# EAGLE design driver (EAGLE 5.11)
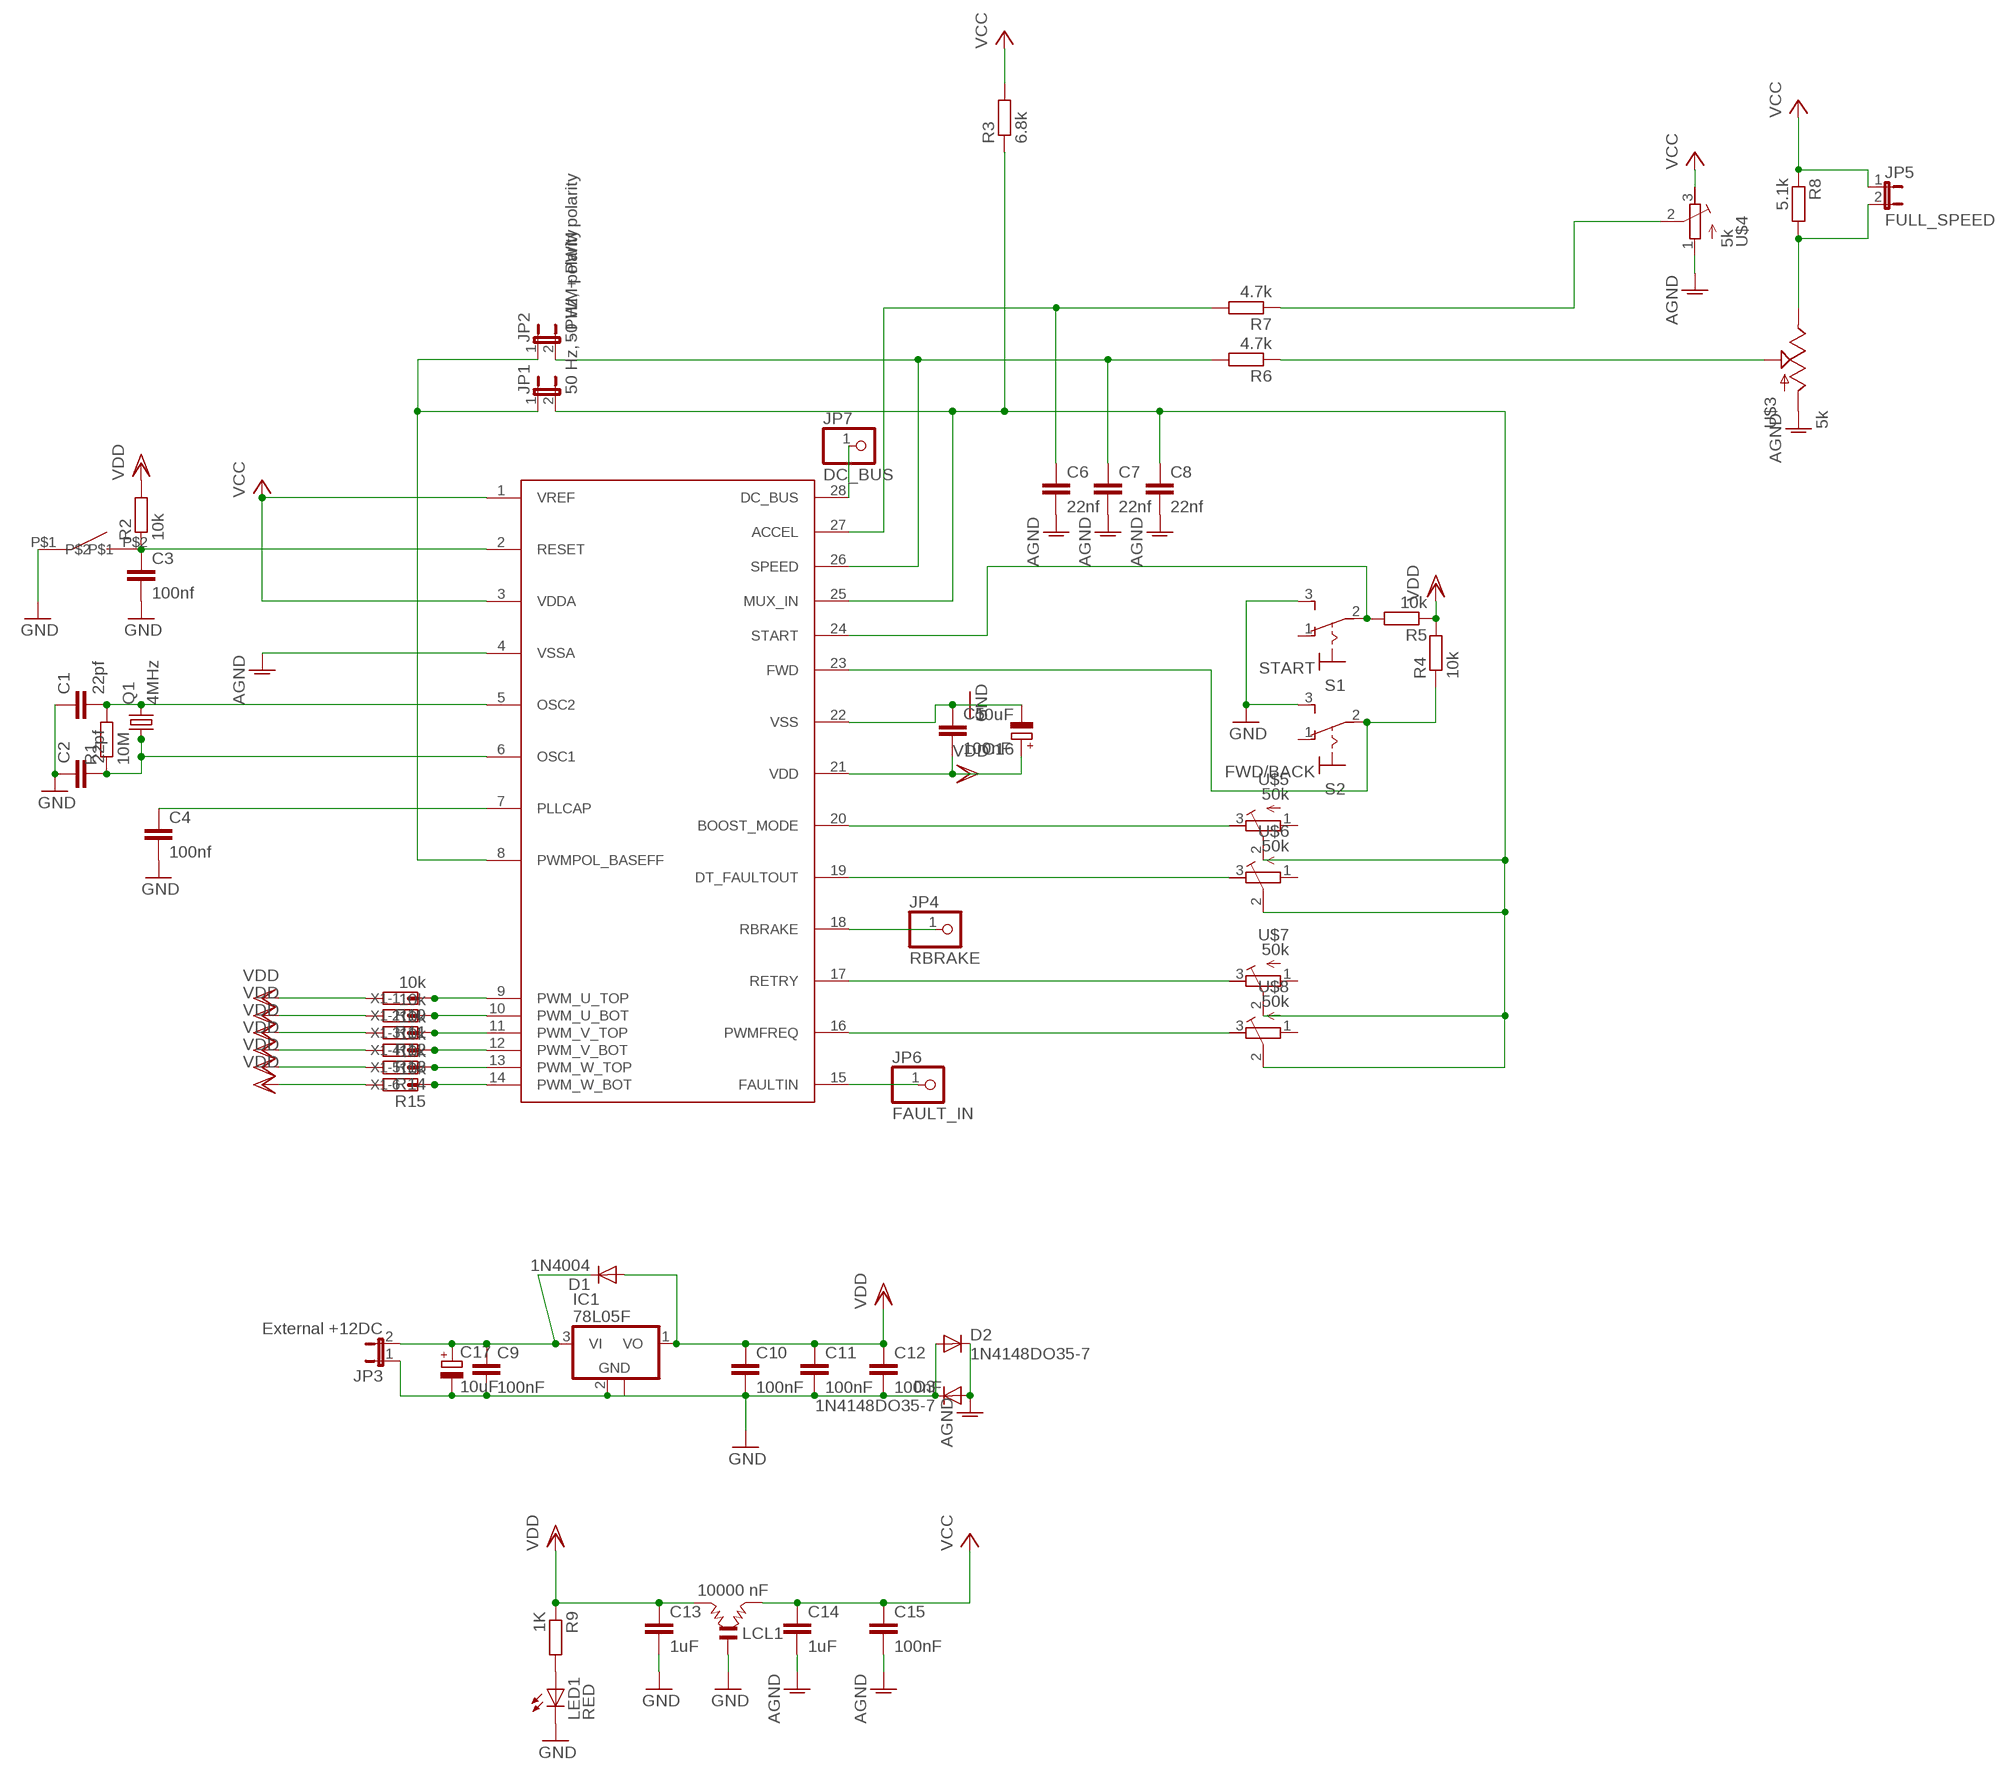
[diagram p0: schematic, sheet 1]

## Parts
C1  22pf  C-EUC0805  [C0805]
C2  22pf  C-EUC0805  [C0805]
C3  100nf  C-EUC0805  [C0805]
C4  100nf  C-EUC0805  [C0805]
C5  100nF  C-EUC0805  [C0805]
C6  22nf  C-EUC0805  [C0805]
C7  22nf  C-EUC0805  [C0805]
C8  22nf  C-EUC0805  [C0805]
C9  100nF  C-EUC0805  [C0805]
C10  100nF  C-EUC0805  [C0805]
C11  100nF  C-EUC0805  [C0805]
C12  100nF  C-EUC0805  [C0805]
C13  1uF  C-EUC0805  [C0805]
C14  1uF  C-EUC0805  [C0805]
C15  100nF  C-EUC0805  [C0805]
C16  10uF  CPOL-EUE2,5-6E  [E2,5-6E]
C17  10uF  CPOL-EUE2,5-6E  [E2,5-6E]
D1  1N4004  [DO41-10]
D2  1N4148DO35-7  DIODE-SOD80C  [SOD80C]
D3  1N4148DO35-7  DIODE-SOD80C  [SOD80C]
IC1  78L05F  [SOT89]
JP1  50 Hz, - PWM polarity  JUMPER-2PTH  [1X02]
JP2  50 Hz, + PWM polarity  JUMPER-2PTH  [1X02]
JP3  External +12DC  JUMPER-2PTH  [1X02]
JP4  RBRAKE  PINHD-1X1  [1X01]
JP5  FULL_SPEED  JUMPER-2PTH  [1X02]
JP6  FAULT_IN  PINHD-1X1  [1X01]
JP7  DC_BUS  PINHD-1X1  [1X01]
LCL1  10000 nF  LCL  [LCL]
LED1  RED  LED5MM  [LED5MM]
Q1  4MHz  CRYSTALHC49S  [HC49/S]
R1  10M  R-EU_R0805  [R0805]
R2  10k  R-EU_R0805  [R0805]
R3  6.8k  R-EU_R0805  [R0805]
R4  10k  R-EU_R0805  [R0805]
R5  10k  R-EU_R0805  [R0805]
R6  4.7k  R-EU_R0805  [R0805]
R7  4.7k  R-EU_R0805  [R0805]
R8  5.1k  R-EU_R0805  [R0805]
R9  1K  R-EU_R0805  [R0805]
R10  10k  R-EU_R0805  [R0805]
R11  10k  R-EU_R0805  [R0805]
R12  10k  R-EU_R0805  [R0805]
R13  10k  R-EU_R0805  [R0805]
R14  10k  R-EU_R0805  [R0805]
R15  10k  R-EU_R0805  [R0805]
S1  START  320-916  [320-916]
S2  FWD/BACK  320-916  [320-916]
U$1  MC3PHAC  [SO-28W]
U$2  TAC_SWITCH-3302  [TAC_SWITCH]
U$3  5k  POT-RV16AF-20  [POT_ALPHA_RV16AF-20]
U$4  5k  R-TRIMM3339P  [RTRIM3339P]
U$5  50k  R-TRIMM3339P  [RTRIM3339P]
U$6  50k  R-TRIMM3339P  [RTRIM3339P]
U$7  50k  R-TRIMM3339P  [RTRIM3339P]
U$8  50k  R-TRIMM3339P  [RTRIM3339P]
X1  22-23-2061  [22-23-2061]

## Nets
AGND: C6.2 C7.2 C8.2 C14.2 C15.2 D2.C D3.A U$1.4(VSSA) U$3.1(A) U$4.1(E)
GND: C1.1 C2.1 C3.2 C4.2 C5.1 C9.2 C10.2 C11.2 C12.2 C13.2 C16.- C17.- D2.A D3.C IC1.2(GND) JP3.1 LCL1.0(GND) LED1.K(C) S1.3(S) S2.3(S) U$1.22(VSS) U$2.P$1
N$1: C1.2 Q1.2 R1.2 U$1.5(OSC2)
N$2: C2.2 Q1.1 R1.1 U$1.6(OSC1)
N$3: JP1.1 JP2.1 U$1.8(PWMPOL_BASEFF)
N$4: C4.1 U$1.7(PLLCAP)
N$5: C3.1 R2.1 U$1.2(RESET) U$2.P$2
N$6: U$1.19(DT_FAULTOUT) U$6.3(A)
N$7: C7.1 JP2.2 R6.2 U$1.26(SPEED)
N$8: C8.1 JP1.2 R3.1 U$1.25(MUX_IN) U$5.2(S) U$6.2(S) U$7.2(S) U$8.2(S)
N$9: C6.1 R7.2 U$1.27(ACCEL)
N$10: R5.2 S1.2(P) U$1.24(START)
N$11: R6.1 U$3.2(S)
N$12: R4.1 S2.2(P) U$1.23(FWD)
N$13: R7.1 U$4.2(S)
N$14: JP5.2 R8.2 U$3.3(E)
N$15: U$1.17(RETRY) U$7.3(A)
N$16: U$1.20(BOOST_MODE) U$5.3(A)
N$17: U$1.16(PWMFREQ) U$8.3(A)
N$18: JP4.1 U$1.18(RBRAKE)
N$19: LED1.A R9.2
N$20: C9.1 C17.+ D1.C IC1.3(VI) JP3.2
N$21: JP6.1 U$1.15(FAULTIN)
N$22: JP7.1 U$1.28(DC_BUS)
N$23: R10.1 U$1.9(PWM_U_TOP) X1.1
N$24: R11.1 U$1.10(PWM_U_BOT) X1.2
N$25: R12.1 U$1.11(PWM_V_TOP) X1.3
N$26: R13.1 U$1.12(PWM_V_BOT) X1.4
N$27: R14.1 U$1.13(PWM_W_TOP) X1.5
N$28: R15.1 U$1.14(PWM_W_BOT) X1.6
VCC: C14.1 C15.1 JP5.1 LCL1.2 R3.2 R8.1 U$1.1(VREF) U$1.3(VDDA) U$4.3(A)
VDD: C5.2 C10.1 C11.1 C12.1 C13.1 C16.+ D1.A IC1.1(VO) LCL1.1 R2.2 R4.2 R5.1 R9.1 R10.2 R11.2 R12.2 R13.2 R14.2 R15.2 U$1.21(VDD)
Unconnected: IC1.2@1(GND) S1.1(O) S2.1(O) U$5.1(E) U$6.1(E) U$7.1(E) U$8.1(E)

## Library data of the parts
C1-C15 = resistor:C-EU: CAPACITOR, European symbol
C16 C17 = resistor:CPOL-EU: POLARIZED CAPACITOR, European symbol
D1 = diode:1N4004: DIODE general purpose rectifier, 1 A
D2 D3 = diode:DIODE-: DIODE
IC1 = linear:78L*: POSITOIV-VOLTAGE REGULATORS Output up to 100 mA Source: http://focus.ti.com/lit/ds/symlink/ua78l05.pdf
JP1-JP3 JP5 = SparkFun:JUMPER-2: Jumper Basic 0.1" spaced jumper. Use with breakaway headers.
JP4 JP6 JP7 = pinhead:PINHD-1X1: PIN HEADER
LCL1 = murata-filter:LCL: FILTER; MPN: LCL; OC_FARNELL: 106331; OC_NEWARK: 06WX8509
LED1 = led:LED: LED OSRAM: - CHIPLED LG R971, LG N971, LY N971, LG Q971, LY Q971, LO R971, LY R971 LH N974, LH R974 LS Q976, LO Q976, LY Q976 LO Q996 - Hyper CHIPLED LW Q18S LB Q993, LB Q99A, LB R99A - SideLED LS A670, LO A670, LY A670, LG A670, LP A670 LB A673, LV A673, LT A673, LW A673 LH A674 LY A675 LS A676, LA A676, LO A676, LY A676, LW A676 LS A679, LY A679, LG A679 - Hyper Micro SIDELED® LS Y876, LA Y876, LO Y876, LY Y876 LT Y87S - SmartLED LW L88C, LW L88S LB L89C, LB L89S, LG L890 LS L89K, LO L89K, LY L89K LS L896, LA L896, LO L896, LY L896 - TOPLED LS T670, LO T670, LY T670, LG T670, LP T670 LSG T670, LSP T670, LSY T670, LOP T670, LYG T670 LG T671, LOG T671, LSG T671 LB T673, LV T673, LT T673, LW T673 LH T674 LS T676, LA T676, LO T676, LY T676, LB T676, LH T676, LSB T676, LW T676 LB T67C, LV T67C, LT T67C, LS T67K, LO T67K, LY T67K, LW E67C LS E67B, LA E67B, LO E67B, LY E67B, LB E67C, LV E67C, LT E67C LW T67C LS T679, LY T679, LG T679 LS T770, LO T770, LY T770, LG T770, LP T770 LB T773, LV T773, LT T773, LW T773 LH T774 LS E675, LA E675, LY E675, LS T675 LS T776, LA T776, LO T776, LY T776, LB T776 LHGB T686 LT T68C, LB T68C - Hyper Mini TOPLED® LB M676 - Mini TOPLED Santana® LG M470 LS M47K, LO M47K, LY M47K Source: http://www.osram.convergy.de LUXEON: - LUMILED® LXK2-PW12-R00, LXK2-PW12-S00, LXK2-PW14-U00, LXK2-PW14-V00 LXK2-PM12-R00, LXK2-PM12-S00, LXK2-PM14-U00 LXK2-PE12-Q00, LXK2-PE12-R00, LXK2-PE12-S00, LXK2-PE14-T00, LXK2-PE14-U00 LXK2-PB12-K00, LXK2-PB12-L00, LXK2-PB12-M00, LXK2-PB14-N00, LXK2-PB14-P00, LXK2-PB14-Q00 LXK2-PR12-L00, LXK2-PR12-M00, LXK2-PR14-Q00, LXK2-PR14-R00 LXK2-PD12-Q00, LXK2-PD12-R00, LXK2-PD12-S00 LXK2-PH12-R00, LXK2-PH12-S00 LXK2-PL12-P00, LXK2-PL12-Q00, LXK2-PL12-R00 Source: www.luxeon.com KINGBRIGHT: KA-3528ASYC Source: www.kingbright.com
Q1 = crystal:CRYSTAL: CRYSTAL; OC_FARNELL: 1667008; OC_NEWARK: unknown
R1-R15 = resistor:R-EU_: RESISTOR, European symbol
S1 S2 = switch:320-916: TOGGLE SWITCH distributor RS Components
U$1 = motor driver parts:MC3PHAC
U$2 = motor driver parts:TAC_SWITCH-3302
U$3 = SparkFun:POT
U$4-U$8 = resistor:R-TRIMM: Trimm resistor
X1 = con-molex:22-23-2061: .100" (2.54mm) Center Header - 6 Pin; MF: MOLEX; MPN: 22-23-2061; OC_FARNELL: 1462922; OC_NEWARK: 27C1933

## Board
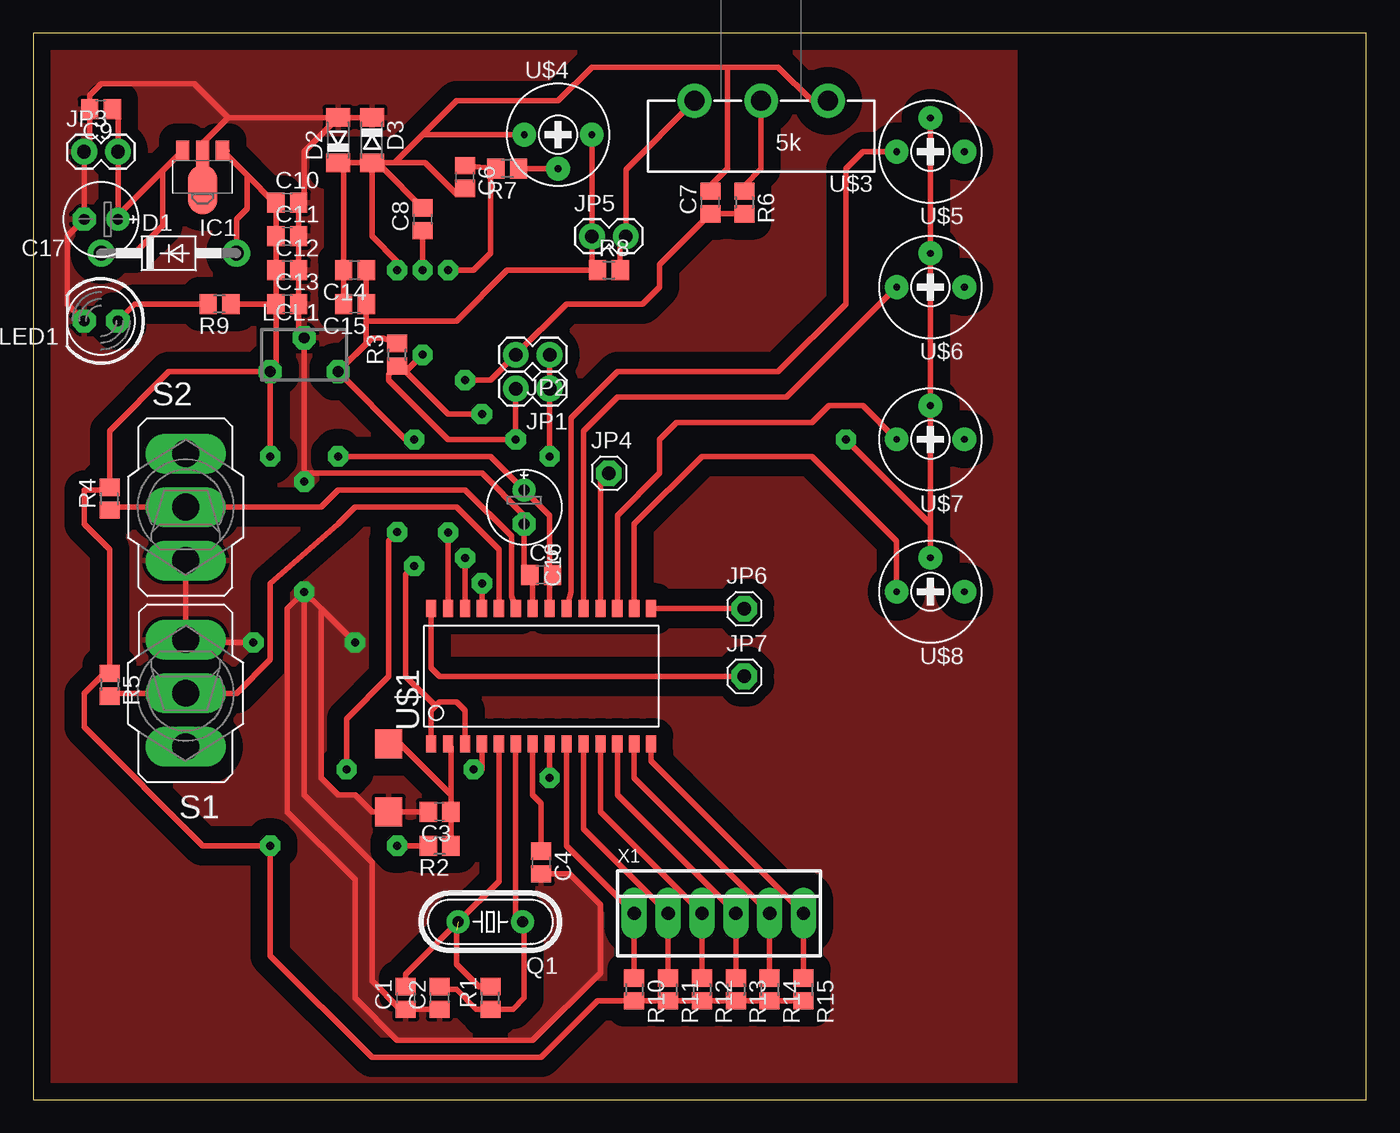
[diagram p1: board, top side]
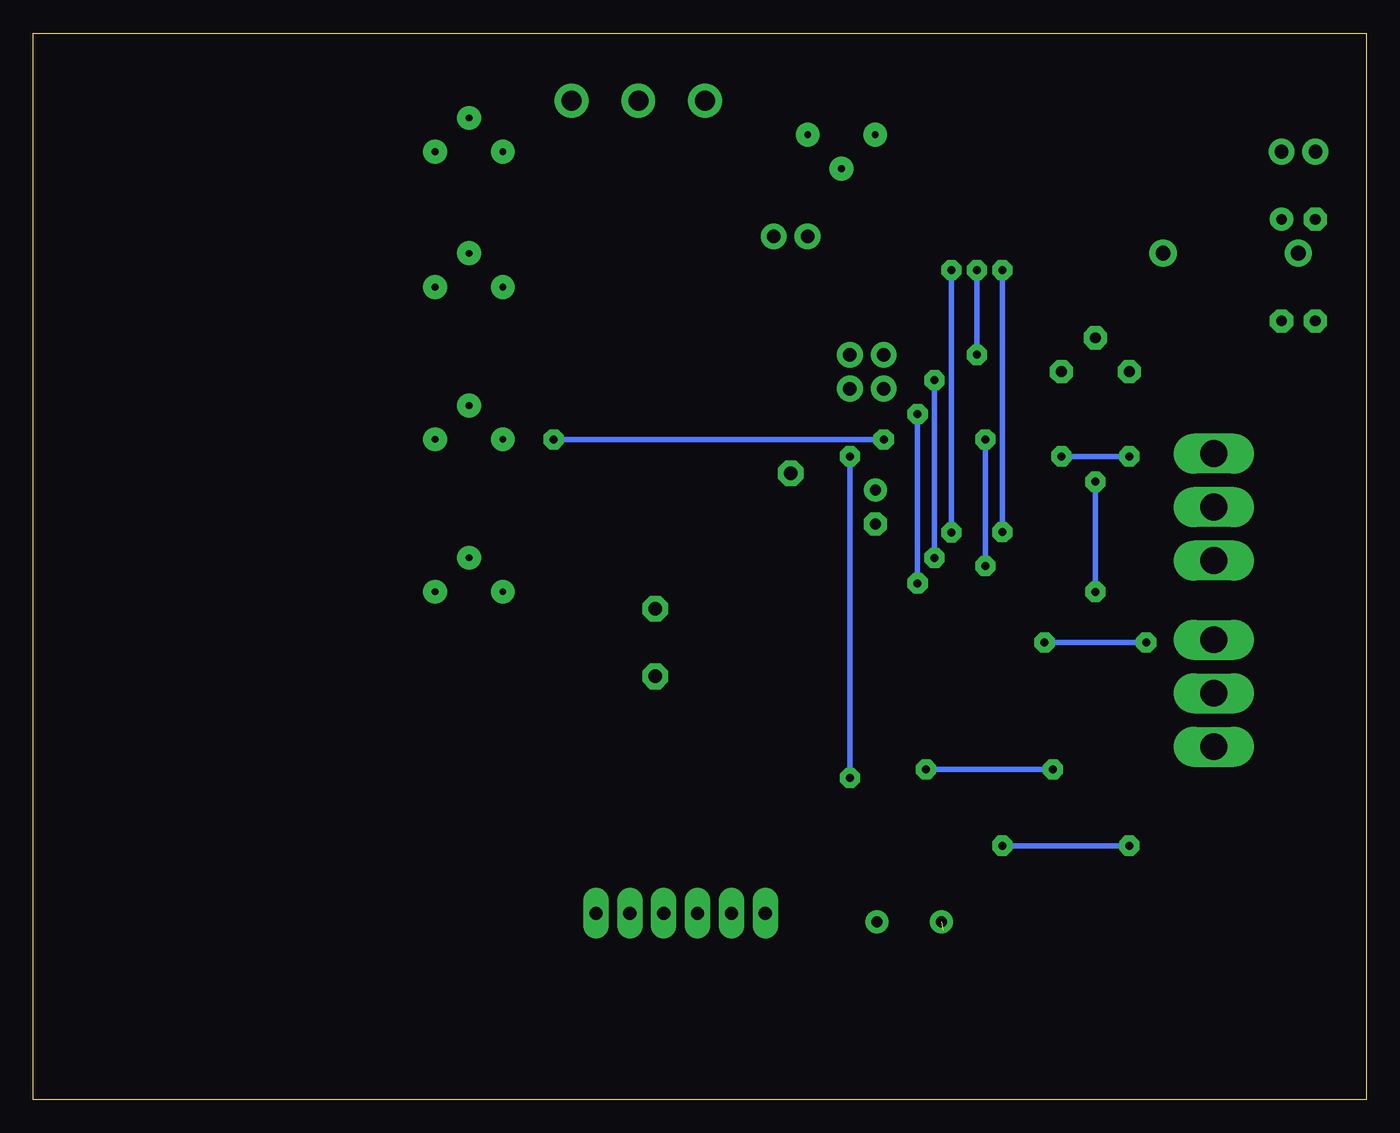
[diagram p2: board, bottom side, seen from below]

Size 100 x 80 mm. Coordinates in mm from the lower left corner, seen from the top.
Outline: 0,0 100,0 100,80 0,80 0,0
Copper layers (1*16): Top 0.035mm / dielectric 1.5mm / Bottom 0.035mm
Design rules "default *": minimum track width 10mil, minimum drill 10mil, track to track 8mil, track to pad 8mil, pad to pad 8mil, via to via 8mil, smd to smd 8mil, copper to edge 40mil, drill to drill 8mil, minimum pad ring 18mil, minimum via ring 18mil, stop-mask expansion 4mil, vias tented up to drill 0mil, thermal gap 10mil

### Footprints (pad centres in the part's own frame; a part is rotated, then mirrored left to right if it is on the bottom)
C0805 = smd 1.3 x 1.5: 1 -0.85,0; 2 0.85,0
E2,5-6E = drill 0.813 pad 1.575 round: + -1.27,0 | drill 0.813 pad 1.575 octagon: - 1.27,0
DO41-10 = drill 1.118 round: A 5.08,0; C -5.08,0
SOD80C = smd 1.4 x 1.8: A 1.7,0; C -1.7,0
SOT89 = smd 1 x 1.5: 1 -1.499,-1.981; 3 1.499,-1.981 | smd 1 x 2: 2 0,-1.727 | smd 2.2 x 3.7: 2@1 0,0.94
1X02 = drill 1.016 pad 1.88 round: 1 0,0; 2 2.54,0
1X01 = drill 1.016 octagon: 1 0,0
LCL = drill 0.813 octagon: 0 0,1.27; 1 -2.54,-1.27; 2 2.54,-1.27
LED5MM = drill 0.813 octagon: A -1.27,0; K 1.27,0
HC49/S = drill 0.813 round: 1 -2.413,0; 2 2.413,0
R0805 = smd 1.3 x 1.5: 1 -0.85,0; 2 0.85,0
320-916 = drill 2.007 long: 1 0,4.013; 2 0,0; 3 0,-4.013
SO-28W = smd 0.762 x 1.27: 1 -8.255,-5.08; 2 -6.985,-5.08; 3 -5.715,-5.08; 4 -4.445,-5.08; 5 -3.175,-5.08; 6 -1.905,-5.08; 7 -0.635,-5.08; 8 0.635,-5.08; 9 1.905,-5.08; 10 3.175,-5.08; 11 4.445,-5.08; 12 5.715,-5.08; 13 6.985,-5.08; 14 8.255,-5.08; 15 8.255,5.08; 16 6.985,5.08; 17 5.715,5.08; 18 4.445,5.08; 19 3.175,5.08; 20 1.905,5.08; 21 0.635,5.08; 22 -0.635,5.08; 23 -1.905,5.08; 24 -3.175,5.08; 25 -4.445,5.08; 26 -5.715,5.08; 27 -6.985,5.08; 28 -8.255,5.08
TAC_SWITCH = smd 2.184 x 2.032: P$1 -2.54,0; P$2 2.54,0
POT_ALPHA_RV16AF-20 = drill 1.5 pad 2.54 round: 1 -5,0; 2 0,0; 3 5,0
RTRIM3339P = drill 0.5 pad 1.778 round: 1 -2.54,0; 2 0,-2.54; 3 2.54,0
22-23-2061 = drill 1 long: 1 -6.35,0; 2 -3.81,0; 3 -1.27,0; 4 1.27,0; 5 3.81,0; 6 6.35,0

### Placement (x,y rotation side)
C1  27.94,7.62 90 top
C2  30.48,7.62 90 top
C3  30.48,21.59 180 top
C4  38.1,17.78 270 top
C5  38.1,39.37 0 top
C6  32.38,69.22 270 top
C7  50.8,67.31 90 top
C8  29.21,66.04 90 top
C9  5.08,74.3 180 top
C10  19.05,67.31 0 top
C11  19.05,64.77 0 top
C12  19.05,62.23 0 top
C13  19.05,59.69 0 top
C14  24.13,62.23 180 top
C15  24.13,59.69 180 top
C16  36.83,44.45 270 top
C17  5.08,66.04 180 top
D1  10.16,63.5 0 top
D2  22.86,71.98 90 top
D3  25.4,71.98 270 top
IC1  12.7,69.22 180 top
JP1  38.73,53.34 180 top
JP2  38.73,55.88 180 top
JP3  3.81,71.12 0 top
JP4  43.18,46.99 0 top
JP5  41.91,64.77 0 top
JP6  53.34,36.83 0 top
JP7  53.34,31.75 0 top
LCL1  20.32,55.88 0 top
LED1  5.08,58.42 180 top
Q1  34.29,13.34 180 top
R1  34.29,7.62 90 top
R2  30.48,19.05 180 top
R3  27.3,55.88 90 top
R4  5.71,45.09 90 top
R5  5.71,31.11 270 top
R6  53.34,67.31 270 top
R7  35.56,69.85 180 top
R8  43.18,62.23 0 top
R9  13.97,59.69 180 top
R10  45.09,8.26 270 top
R11  47.62,8.26 270 top
R12  50.16,8.26 270 top
R13  52.7,8.26 270 top
R14  55.24,8.26 270 top
R15  57.78,8.26 270 top
S1  11.43,30.48 180 top
S2  11.43,44.45 0 top
U$1  38.1,31.75 0 top
U$2  26.67,24.13 90 top
U$3  54.61,74.93 180 top
U$4  39.37,72.39 0 top
U$5  67.31,71.12 180 top
U$6  67.31,60.96 180 top
U$7  67.31,49.53 180 top
U$8  67.31,38.1 180 top
X1  51.44,13.97 0 top

### Tracks (layer width: path | path; a pad name or v marks a point on that pad's centre or on a via)
AGND  (via drill 0.6)
  Top 0.406: C15.2 C14.2 23.28,69.58 D2.C D3.A | 29.21,72.39 U$4.1 | D3.A 25.82,69.94 26.16,69.94 C8.2 | U$3.1 58.42,74.93 55.88,77.47 52.07,77.47 | 52.07,77.47 41.91,77.47 39.37,74.93 31.75,74.93 29.21,72.39 | C7.2 50.8,68.58 52.07,69.85 52.07,77.47 | U$1.4 33.66,24.77 v33.02,24.77 | v23.5,24.77 23.5,28.57 26.67,31.75 26.67,41.91 27.3,42.55 v27.3,42.57 | D3.A 25.4,64.77 27.3,62.87 v27.3,62.23 | 27.1,70.28 29.21,72.39 | D3.A 27.1,70.28 | C6.2 31.96,67.94 31.75,67.94 29.41,70.28 27.1,70.28
  Bottom 0.406: v23.5,24.77 v33.02,24.77 | v27.3,42.57 v27.3,62.23
GND  (via drill 0.6)
  Top 0.406: D2.A D3.C | LED1.K 2.54,59.69 2.54,64.77 C17.- JP3.1 4.23,71.54 C9.2 4.23,75.35 5.08,76.2 12.06,76.2 14.61,73.66 | C2.1 C1.1 27.52,6.77 25.4,8.89 25.4,17.78 20.32,22.86 v20.32,38.1 | S1.3 S2.3 11.43,34.29 v16.51,34.29 | U$1.22 37.47,38.52 C5.1 36.83,39.16 C16.- 36.83,43.81 33.66,46.99 20.32,46.99 | 20.32,46.99 LCL1.0 19.9,57.57 C13.2 C12.2 C11.2 C10.2 20.32,67.31 20.32,71.12 D2.A | v20.32,46.35 20.32,46.99 | v20.32,38.1 21.59,36.83 | C3.2 U$2.P$1 25.4,21.59 24.13,22.86 22.86,22.86 21.59,24.13 21.59,36.83 | v20.32,38.1 19.05,36.83 19.05,21.59 24.13,16.51 24.13,7.62 27.3,4.45 37.47,4.45 42.55,9.53 42.55,14.61 40.22,16.93 C4.2 | 21.59,36.83 v24.13,34.29 | D2.A 14.63,73.68 14.61,73.66 | 14.61,73.66 12.7,71.75 IC1.2
  Bottom 0.406: v20.32,38.1 v20.32,46.35 | v24.13,34.29 v16.51,34.29
  pour Top (isolate 1.27): 0,80.01 73.66,80.01 73.66,1.27 0,1.27
N$1  (1 unrouted)
  Top 0.406: R1.2 33.44,8.47 31.75,10.16 31.75,12.7 | U$1.5 34.92,16.38 Q1.2 27.94,9.4 C1.2
N$2
  Top 0.406: C2.2 30.7,8.26 31.75,8.26 33.23,6.77 R1.1 35.98,6.77 36.83,7.62 36.83,12.7 Q1.1 36.2,13.84 U$1.6
N$3  (via drill 0.6)
  Top 0.406: JP2.1 JP1.1 v38.73,48.26 | v38.73,24.13 U$1.8
  Bottom 0.406: v38.73,24.13 v38.73,48.26
N$4
  Top 0.406: U$1.7 37.47,22.86 38.1,22.23 C4.1
N$5
  Top 0.406: R2.1 C3.1 31.33,22.86 | U$1.2 31.33,26.45 31.33,22.86 | U$2.P$2 27.52,26.67 31.33,22.86
N$6
  Top 0.406: U$6.3 56.52,52.7 43.81,52.7 41.27,50.16 U$1.19
N$7  (via drill 0.6)
  Top 0.406: R6.2 C7.1 46.99,62.65 46.99,60.96 45.72,59.69 40.01,59.69 JP2.2 34.29,53.98 v32.38,53.98 | U$1.26 v32.38,40.64
  Bottom 0.406: v32.38,40.64 v32.38,53.98
N$8  (via drill 0.6)
  Top 0.406: U$5.2 U$6.2 U$7.2 67.31,43.18 | U$1.25 v33.66,38.73 | 67.31,43.18 U$8.2 | v29.21,62.23 C8.1 | JP1.2 v36.2,49.53 31.11,49.53 26.67,53.98 26.67,54.4 R3.1 27.73,54.61 27.94,54.61 | 27.94,54.61 v29.21,55.88 | v60.96,49.53 67.31,43.18 | v33.66,51.44 31.11,51.44 27.94,54.61
  Bottom 0.406: v33.66,38.73 v33.66,51.44 | v29.21,55.88 v29.21,62.23 | v36.2,49.53 v60.96,49.53
N$9  (via drill 0.6)
  Top 0.406: C6.1 R7.2 34.29,69.43 34.29,63.5 33.02,62.23 v31.11,62.23 | U$1.27 v31.11,42.55
  Bottom 0.406: v31.11,42.55 v31.11,62.23
N$10
  Top 0.406: R5.2 5.93,30.48 S1.2 15.24,30.48 17.78,33.02 17.78,38.73 22.86,43.18 24.13,44.45 31.75,44.45 34.92,41.27 U$1.24
N$11
  Top 0.406: R6.1 53.34,68.58 54.61,69.85 U$3.2
N$12
  Top 0.406: R4.1 5.93,44.45 S2.2 21.59,44.45 22.86,45.72 32.38,45.72 35.87,42.27 35.87,37.8 U$1.23
N$13
  Top 0.406: R7.1 U$4.2
N$14
  Top 0.406: R8.2 44.03,64.35 JP5.2 44.45,69.77 U$3.3
N$15
  Top 0.406: U$7.3 62.23,52.07 59.69,52.07 58.42,50.8 48.26,50.8 46.99,49.53 46.99,46.99 43.81,43.81 U$1.17
N$16
  Top 0.406: U$5.3 62.23,71.12 60.96,69.85 60.96,59.69 55.88,54.61 43.81,54.61 40.34,51.13 40.34,38.1 U$1.20
N$17
  Top 0.406: U$8.3 64.77,41.91 58.42,48.26 50.16,48.26 45.09,43.18 U$1.16
N$18
  Top 0.406: U$1.18 42.55,46.35 JP4.1
N$19
  Top 0.406: LED1.A 7.62,59.69 R9.2
N$20
  Top 0.406: C9.1 6.35,73.88 JP3.2 C17.+ 6.35,66.34 9.69,69.69 | 9.69,69.69 IC1.3 | D1.C 7.62,63.5 9.69,65.57 9.69,69.69
N$21
  Top 0.406: U$1.15 JP6.1
N$22
  Top 0.406: U$1.28 29.84,32.38 30.48,31.75 JP7.1
N$23
  Top 0.406: U$1.9 40.01,19.05 X1.1 R10.1
N$24
  Top 0.406: U$1.10 41.27,20.32 X1.2 R11.1
N$25
  Top 0.406: U$1.11 42.55,21.59 X1.3 R12.1
N$26
  Top 0.406: U$1.12 43.81,22.86 X1.4 R13.1
N$27
  Top 0.406: U$1.13 45.09,24.13 X1.5 R14.1
N$28
  Top 0.406: U$1.14 46.35,25.4 X1.6 R15.1
VCC  (via drill 0.6)
  Top 0.406: C14.1 C15.1 24.98,58.42 | 24.98,58.42 24.98,56.73 LCL1.2 | U$1.1 29.84,29.21 30.16,29.53 | 30.16,29.53 30.48,29.84 31.75,29.84 32.38,29.21 U$1.3 | v28.57,40.03 27.94,39.4 27.94,31.75 30.16,29.53 | R3.2 26.25,57.15 25.4,57.15 LCL1.2 | U$4.3 JP5.1 41.91,62.65 R8.1 35.56,62.23 31.75,58.42 24.98,58.42 | v28.57,49.53 27.94,49.53 LCL1.2
  Bottom 0.406: v28.57,40.03 v28.57,49.53
VDD  (via drill 0.6)
  Top 0.406: C13.1 C12.1 C11.1 C10.1 18.09,67.31 16.03,69.37 | D1.A 15.24,66.06 16.03,66.85 16.03,69.37 | C13.1 R9.1 | LCL1.1 10.16,54.61 5.71,50.16 R4.2 5.5,45.72 3.81,45.72 3.81,43.18 5.71,41.27 R5.1 5.5,31.75 5.08,31.75 3.81,30.48 3.81,27.94 12.7,19.05 v17.78,19.05 17.78,10.79 25.4,3.17 38.1,3.17 42.33,7.41 R10.2 R11.2 R12.2 R13.2 R14.2 R15.2 | C13.1 18.2,55.03 LCL1.1 | U$1.21 38.73,38.52 C5.2 38.73,38.95 38.73,43.81 C16.+ 34.29,48.26 v22.86,48.26 | v27.3,19.05 R2.2 | LCL1.1 v17.78,48.26 | 14.53,71.2 IC1.1 16.03,69.37
  Bottom 0.406: v17.78,19.05 v27.3,19.05 | v17.78,48.26 v22.86,48.26